# Altium schematic sheet OSD19001_BREAKOUTS.SchDoc: <title>
size B; CompanyName: Allied Component Works; Organization: Altium Limited; DocumentNumber: 3; Revision: X1; SheetNumber: 3; SheetTotal: 4; DrawingNumber: <drawing number>; SchematicTitle: OSD32MP1 BREAKOUT MODULE (BREAKOUTS)
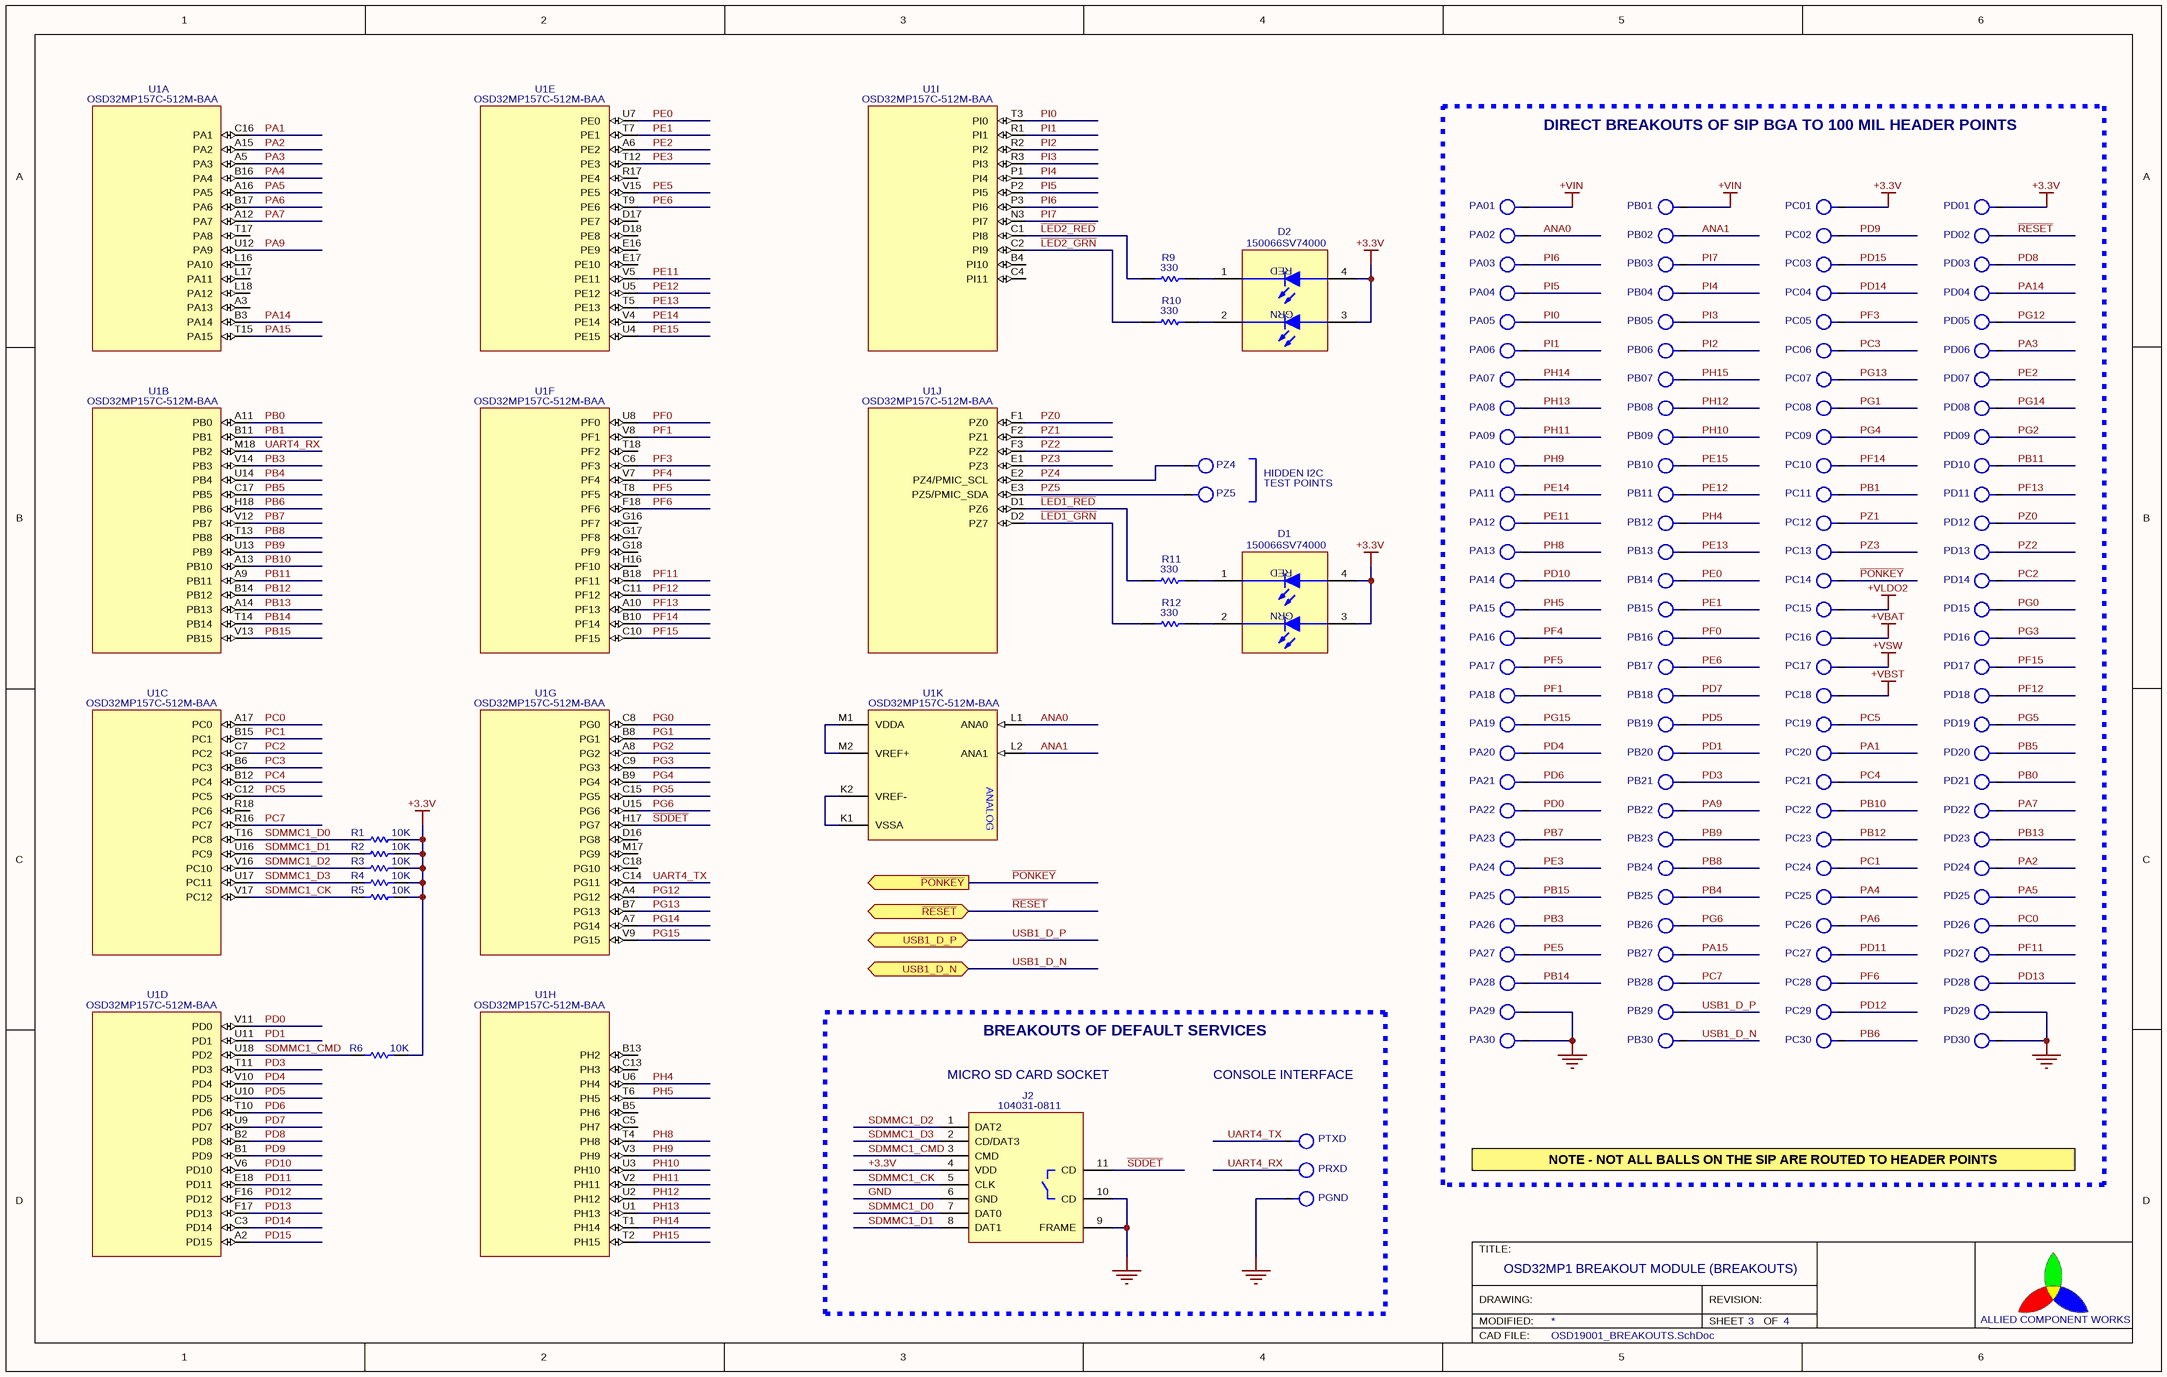
[diagram p0: OSD19001_BREAKOUTS.SchDoc]

## Parts
D1  150066SV74000  [WURTH_DUAL_0606]
D2  150066SV74000  [WURTH_DUAL_0606]
J2  104031-0811  [MOLEX_104031-0811]
PA01  TP  [LP_TESTPOINT_TH]  (value not drawn)
PA02  TP  [LP_TESTPOINT_TH]  (value not drawn)
PA03  TP  [LP_TESTPOINT_TH]  (value not drawn)
PA04  TP  [LP_TESTPOINT_TH]  (value not drawn)
PA05  TP  [LP_TESTPOINT_TH]  (value not drawn)
PA06  TP  [LP_TESTPOINT_TH]  (value not drawn)
PA07  TP  [LP_TESTPOINT_TH]  (value not drawn)
PA08  TP  [LP_TESTPOINT_TH]  (value not drawn)
PA09  TP  [LP_TESTPOINT_TH]  (value not drawn)
PA10  TP  [LP_TESTPOINT_TH]  (value not drawn)
PA11  TP  [LP_TESTPOINT_TH]  (value not drawn)
PA12  TP  [LP_TESTPOINT_TH]  (value not drawn)
PA13  TP  [LP_TESTPOINT_TH]  (value not drawn)
PA14  TP  [LP_TESTPOINT_TH]  (value not drawn)
PA15  TP  [LP_TESTPOINT_TH]  (value not drawn)
PA16  TP  [LP_TESTPOINT_TH]  (value not drawn)
PA17  TP  [LP_TESTPOINT_TH]  (value not drawn)
PA18  TP  [LP_TESTPOINT_TH]  (value not drawn)
PA19  TP  [LP_TESTPOINT_TH]  (value not drawn)
PA20  TP  [LP_TESTPOINT_TH]  (value not drawn)
PA21  TP  [LP_TESTPOINT_TH]  (value not drawn)
PA22  TP  [LP_TESTPOINT_TH]  (value not drawn)
PA23  TP  [LP_TESTPOINT_TH]  (value not drawn)
PA24  TP  [LP_TESTPOINT_TH]  (value not drawn)
PA25  TP  [LP_TESTPOINT_TH]  (value not drawn)
PA26  TP  [LP_TESTPOINT_TH]  (value not drawn)
PA27  TP  [LP_TESTPOINT_TH]  (value not drawn)
PA28  TP  [LP_TESTPOINT_TH]  (value not drawn)
PA29  TP  [LP_TESTPOINT_TH]  (value not drawn)
PA30  TP  [LP_TESTPOINT_TH]  (value not drawn)
PB01  TP  [LP_TESTPOINT_TH]  (value not drawn)
PB02  TP  [LP_TESTPOINT_TH]  (value not drawn)
PB03  TP  [LP_TESTPOINT_TH]  (value not drawn)
PB04  TP  [LP_TESTPOINT_TH]  (value not drawn)
PB05  TP  [LP_TESTPOINT_TH]  (value not drawn)
PB06  TP  [LP_TESTPOINT_TH]  (value not drawn)
PB07  TP  [LP_TESTPOINT_TH]  (value not drawn)
PB08  TP  [LP_TESTPOINT_TH]  (value not drawn)
PB09  TP  [LP_TESTPOINT_TH]  (value not drawn)
PB10  TP  [LP_TESTPOINT_TH]  (value not drawn)
PB11  TP  [LP_TESTPOINT_TH]  (value not drawn)
PB12  TP  [LP_TESTPOINT_TH]  (value not drawn)
PB13  TP  [LP_TESTPOINT_TH]  (value not drawn)
PB14  TP  [LP_TESTPOINT_TH]  (value not drawn)
PB15  TP  [LP_TESTPOINT_TH]  (value not drawn)
PB16  TP  [LP_TESTPOINT_TH]  (value not drawn)
PB17  TP  [LP_TESTPOINT_TH]  (value not drawn)
PB18  TP  [LP_TESTPOINT_TH]  (value not drawn)
PB19  TP  [LP_TESTPOINT_TH]  (value not drawn)
PB20  TP  [LP_TESTPOINT_TH]  (value not drawn)
PB21  TP  [LP_TESTPOINT_TH]  (value not drawn)
PB22  TP  [LP_TESTPOINT_TH]  (value not drawn)
PB23  TP  [LP_TESTPOINT_TH]  (value not drawn)
PB24  TP  [LP_TESTPOINT_TH]  (value not drawn)
PB25  TP  [LP_TESTPOINT_TH]  (value not drawn)
PB26  TP  [LP_TESTPOINT_TH]  (value not drawn)
PB27  TP  [LP_TESTPOINT_TH]  (value not drawn)
PB28  TP  [LP_TESTPOINT_TH]  (value not drawn)
PB29  TP  [LP_TESTPOINT_TH]  (value not drawn)
PB30  TP  [LP_TESTPOINT_TH]  (value not drawn)
PC01  TP  [LP_TESTPOINT_TH]  (value not drawn)
PC02  TP  [LP_TESTPOINT_TH]  (value not drawn)
PC03  TP  [LP_TESTPOINT_TH]  (value not drawn)
PC04  TP  [LP_TESTPOINT_TH]  (value not drawn)
PC05  TP  [LP_TESTPOINT_TH]  (value not drawn)
PC06  TP  [LP_TESTPOINT_TH]  (value not drawn)
PC07  TP  [LP_TESTPOINT_TH]  (value not drawn)
PC08  TP  [LP_TESTPOINT_TH]  (value not drawn)
PC09  TP  [LP_TESTPOINT_TH]  (value not drawn)
PC10  TP  [LP_TESTPOINT_TH]  (value not drawn)
PC11  TP  [LP_TESTPOINT_TH]  (value not drawn)
PC12  TP  [LP_TESTPOINT_TH]  (value not drawn)
PC13  TP  [LP_TESTPOINT_TH]  (value not drawn)
PC14  TP  [LP_TESTPOINT_TH]  (value not drawn)
PC15  TP  [LP_TESTPOINT_TH]  (value not drawn)
PC16  TP  [LP_TESTPOINT_TH]  (value not drawn)
PC17  TP  [LP_TESTPOINT_TH]  (value not drawn)
PC18  TP  [LP_TESTPOINT_TH]  (value not drawn)
PC19  TP  [LP_TESTPOINT_TH]  (value not drawn)
PC20  TP  [LP_TESTPOINT_TH]  (value not drawn)
PC21  TP  [LP_TESTPOINT_TH]  (value not drawn)
PC22  TP  [LP_TESTPOINT_TH]  (value not drawn)
PC23  TP  [LP_TESTPOINT_TH]  (value not drawn)
PC24  TP  [LP_TESTPOINT_TH]  (value not drawn)
PC25  TP  [LP_TESTPOINT_TH]  (value not drawn)
PC26  TP  [LP_TESTPOINT_TH]  (value not drawn)
PC27  TP  [LP_TESTPOINT_TH]  (value not drawn)
PC28  TP  [LP_TESTPOINT_TH]  (value not drawn)
PC29  TP  [LP_TESTPOINT_TH]  (value not drawn)
PC30  TP  [LP_TESTPOINT_TH]  (value not drawn)
PD01  TP  [LP_TESTPOINT_TH]  (value not drawn)
PD02  TP  [LP_TESTPOINT_TH]  (value not drawn)
PD03  TP  [LP_TESTPOINT_TH]  (value not drawn)
PD04  TP  [LP_TESTPOINT_TH]  (value not drawn)
PD05  TP  [LP_TESTPOINT_TH]  (value not drawn)
PD06  TP  [LP_TESTPOINT_TH]  (value not drawn)
PD07  TP  [LP_TESTPOINT_TH]  (value not drawn)
PD08  TP  [LP_TESTPOINT_TH]  (value not drawn)
PD09  TP  [LP_TESTPOINT_TH]  (value not drawn)
PD10  TP  [LP_TESTPOINT_TH]  (value not drawn)
PD11  TP  [LP_TESTPOINT_TH]  (value not drawn)
PD12  TP  [LP_TESTPOINT_TH]  (value not drawn)
PD13  TP  [LP_TESTPOINT_TH]  (value not drawn)
PD14  TP  [LP_TESTPOINT_TH]  (value not drawn)
PD15  TP  [LP_TESTPOINT_TH]  (value not drawn)
PD16  TP  [LP_TESTPOINT_TH]  (value not drawn)
PD17  TP  [LP_TESTPOINT_TH]  (value not drawn)
PD18  TP  [LP_TESTPOINT_TH]  (value not drawn)
PD19  TP  [LP_TESTPOINT_TH]  (value not drawn)
PD20  TP  [LP_TESTPOINT_TH]  (value not drawn)
PD21  TP  [LP_TESTPOINT_TH]  (value not drawn)
PD22  TP  [LP_TESTPOINT_TH]  (value not drawn)
PD23  TP  [LP_TESTPOINT_TH]  (value not drawn)
PD24  TP  [LP_TESTPOINT_TH]  (value not drawn)
PD25  TP  [LP_TESTPOINT_TH]  (value not drawn)
PD26  TP  [LP_TESTPOINT_TH]  (value not drawn)
PD27  TP  [LP_TESTPOINT_TH]  (value not drawn)
PD28  TP  [LP_TESTPOINT_TH]  (value not drawn)
PD29  TP  [LP_TESTPOINT_TH]  (value not drawn)
PD30  TP  [LP_TESTPOINT_TH]  (value not drawn)
PGND  TP  [LP_TESTPOINT_TH]  (value not drawn)
PRXD  TP  [LP_TESTPOINT_TH]  (value not drawn)
PTXD  TP  [LP_TESTPOINT_TH]  (value not drawn)
PZ4  TP  [LP_TESTPOINT_SMT]  (value not drawn)
PZ5  TP  [LP_TESTPOINT_SMT]  (value not drawn)
R1  10K  [LP_0402_LOW]
R2  10K  [LP_0402_LOW]
R3  10K  [LP_0402_LOW]
R4  10K  [LP_0402_LOW]
R5  10K  [LP_0402_LOW]
R6  10K  [LP_0402_LOW]
R9  330  [LP_0402_LOW]
R10  330  [LP_0402_LOW]
R11  330  [LP_0402_LOW]
R12  330  [LP_0402_LOW]
U1  OSD32MP157C-512M-BAA  [BGA_OCTAVO_SIP_OSD32MP157C]  (parts A,B,C,D,E,F,G,H,I,J,K of 17)

## Blocks framed on the sheet
DIRECT BREAKOUTS OF SIP BGA TO 100 MIL HEADER POINTS: PA01 PA02 PA03 PA04 PA05 PA06 PA07 PA08 PA09-PA30 PB01 PB02 PB03 PB04 PB05 PB06 PB07 PB08 PB09-PB30 PC01 PC02 PC03 PC04 PC05 PC06 PC07 PC08 PC09-PC30 PD01 PD02 PD03 PD04 PD05 PD06 PD07 PD08 PD09-PD30
BREAKOUTS OF DEFAULT SERVICES: J2 PGND PRXD PTXD

## Ports
USB1_D_N (bidir), USB1_D_P (bidir), ~{PONKEY} (out), ~{RESET} (bidir)

## Nets
+3.3V: D1.3(A) D1.4(A) D2.3(A) D2.4(A) J2.4(VDD) PC01.1 PD01.1 R1.2 R2.2 R3.2 R4.2 R5.2 R6.2
+VBAT: PC16.1
+VBST: PC18.1
+VIN: PA01.1 PB01.1
+VLDO2: PC15.1
+VSW: PC17.1
GND: J2.6(GND) J2.9(FRAME) J2.10(CD) PA29.1 PA30.1 PD29.1 PD30.1 PGND.1
~{LED1_GRN}: R12.1 U1.D2(PZ7)
~{LED1_RED}: R11.1 U1.D1(PZ6)
~{LED2_GRN}: R10.1 U1.C2(PI9)
~{LED2_RED}: R9.1 U1.C1(PI8)
~{PONKEY}: PC14.1 ; port ~{PONKEY}
~{RESET}: PD02.1 ; port ~{RESET}
~{SDDET}: J2.11(CD) U1.H17(PG7)
ANA0: PA02.1 U1.L1(ANA0)
ANA1: PB02.1 U1.L2(ANA1)
PA1: PC20.1 U1.C16(PA1)
PA2: PD24.1 U1.A15(PA2)
PA3: PD06.1 U1.A5(PA3)
PA4: PC25.1 U1.B16(PA4)
PA5: PD25.1 U1.A16(PA5)
PA6: PC26.1 U1.B17(PA6)
PA7: PD22.1 U1.A12(PA7)
PA9: PB22.1 U1.U12(PA9)
PA14: PD04.1 U1.B3(PA14)
PA15: PB27.1 U1.T15(PA15)
PB0: PD21.1 U1.A11(PB0)
PB1: PC11.1 U1.B11(PB1)
PB3: PA26.1 U1.V14(PB3)
PB4: PB25.1 U1.U14(PB4)
PB5: PD20.1 U1.C17(PB5)
PB6: PC30.1 U1.H18(PB6)
PB7: PA23.1 U1.V12(PB7)
PB8: PB24.1 U1.T13(PB8)
PB9: PB23.1 U1.U13(PB9)
PB10: PC22.1 U1.A13(PB10)
PB11: PD10.1 U1.A9(PB11)
PB12: PC23.1 U1.B14(PB12)
PB13: PD23.1 U1.A14(PB13)
PB14: PA28.1 U1.T14(PB14)
PB15: PA25.1 U1.V13(PB15)
PC0: PD26.1 U1.A17(PC0)
PC1: PC24.1 U1.B15(PC1)
PC2: PD14.1 U1.C7(PC2)
PC3: PC06.1 U1.B6(PC3)
PC4: PC21.1 U1.B12(PC4)
PC5: PC19.1 U1.C12(PC5)
PC7: PB28.1 U1.R16(PC7)
PD0: PA22.1 U1.V11(PD0)
PD1: PB20.1 U1.U11(PD1)
PD3: PB21.1 U1.T11(PD3)
PD4: PA20.1 U1.V10(PD4)
PD5: PB19.1 U1.U10(PD5)
PD6: PA21.1 U1.T10(PD6)
PD7: PB18.1 U1.U9(PD7)
PD8: PD03.1 U1.B2(PD8)
PD9: PC02.1 U1.B1(PD9)
PD10: PA14.1 U1.V6(PD10)
PD11: PC27.1 U1.E18(PD11)
PD12: PC29.1 U1.F16(PD12)
PD13: PD28.1 U1.F17(PD13)
PD14: PC04.1 U1.C3(PD14)
PD15: PC03.1 U1.A2(PD15)
PE0: PB14.1 U1.U7(PE0)
PE1: PB15.1 U1.T7(PE1)
PE2: PD07.1 U1.A6(PE2)
PE3: PA24.1 U1.T12(PE3)
PE5: PA27.1 U1.V15(PE5)
PE6: PB17.1 U1.T9(PE6)
PE11: PA12.1 U1.V5(PE11)
PE12: PB11.1 U1.U5(PE12)
PE13: PB13.1 U1.T5(PE13)
PE14: PA11.1 U1.V4(PE14)
PE15: PB10.1 U1.U4(PE15)
PF0: PB16.1 U1.U8(PF0)
PF1: PA18.1 U1.V8(PF1)
PF3: PC05.1 U1.C6(PF3)
PF4: PA16.1 U1.V7(PF4)
PF5: PA17.1 U1.T8(PF5)
PF6: PC28.1 U1.F18(PF6)
PF11: PD27.1 U1.B18(PF11)
PF12: PD18.1 U1.C11(PF12)
PF13: PD11.1 U1.A10(PF13)
PF14: PC10.1 U1.B10(PF14)
PF15: PD17.1 U1.C10(PF15)
PG0: PD15.1 U1.C8(PG0)
PG1: PC08.1 U1.B8(PG1)
PG2: PD09.1 U1.A8(PG2)
PG3: PD16.1 U1.C9(PG3)
PG4: PC09.1 U1.B9(PG4)
PG5: PD19.1 U1.C15(PG5)
PG6: PB26.1 U1.U15(PG6)
PG12: PD05.1 U1.A4(PG12)
PG13: PC07.1 U1.B7(PG13)
PG14: PD08.1 U1.A7(PG14)
PG15: PA19.1 U1.V9(PG15)
PH4: PB12.1 U1.U6(PH4)
PH5: PA15.1 U1.T6(PH5)
PH8: PA13.1 U1.T4(PH8)
PH9: PA10.1 U1.V3(PH9)
PH10: PB09.1 U1.U3(PH10)
PH11: PA09.1 U1.V2(PH11)
PH12: PB08.1 U1.U2(PH12)
PH13: PA08.1 U1.U1(PH13)
PH14: PA07.1 U1.T1(PH14)
PH15: PB07.1 U1.T2(PH15)
PI0: PA05.1 U1.T3(PI0)
PI1: PA06.1 U1.R1(PI1)
PI2: PB06.1 U1.R2(PI2)
PI3: PB05.1 U1.R3(PI3)
PI4: PB04.1 U1.P1(PI4)
PI5: PA04.1 U1.P2(PI5)
PI6: PA03.1 U1.P3(PI6)
PI7: PB03.1 U1.N3(PI7)
PZ0: PD12.1 U1.F1(PZ0)
PZ1: PC12.1 U1.F2(PZ1)
PZ2: PD13.1 U1.F3(PZ2)
PZ3: PC13.1 U1.E1(PZ3)
PZ4: PZ4.1 U1.E2(PZ4/PMIC_SCL)
PZ5: PZ5.1 U1.E3(PZ5/PMIC_SDA)
SDMMC1_CK: J2.5(CLK) R5.1 U1.V17(PC12)
SDMMC1_CMD: J2.3(CMD) R6.1 U1.U18(PD2)
SDMMC1_D0: J2.7(DAT0) R1.1 U1.T16(PC8)
SDMMC1_D1: J2.8(DAT1) R2.1 U1.U16(PC9)
SDMMC1_D2: J2.1(DAT2) R3.1 U1.V16(PC10)
SDMMC1_D3: J2.2(CD/DAT3) R4.1 U1.U17(PC11)
UART4_RX: PRXD.1 U1.M18(PB2)
UART4_TX: PTXD.1 U1.C14(PG11)
USB1_D_N: PB30.1 ; port USB1_D_N
USB1_D_P: PB29.1 ; port USB1_D_P
NetD1_1: D1.1(K) R11.2
NetD1_2: D1.2(K) R12.2
NetD2_1: D2.1(K) R9.2
NetD2_2: D2.2(K) R10.2
NetU1_K1: U1.K1(VSSA) U1.K2(VREF-)
NetU1_M1: U1.M1(VDDA) U1.M2(VREF+)

Not connected (* = marked no-connect by the designer): U1 A3(PA13) B4(PI10) B5(PH6) B13(PH2) C4(PI11) C5(PH7) C13(PH3) C18(PG10) D16(PG8) D17(PE7) D18(PE8) E16(PE9) E17(PE10) G16(PF7) G17(PF8) G18(PF9) H16(PF10) L16(PA10) L17(PA11) L18(PA12) M17(PG9) R17(PE4) R18(PC6) T17(PA8) T18(PF2)

## Notes on the sheet
- HIDDEN I2C
- TEST POINTS
- (near J2) MICRO SD CARD SOCKET
- CONSOLE INTERFACE
- NOTE - NOT ALL BALLS ON THE SIP ARE ROUTED TO HEADER POINTS
- TITLE:
- DRAWING:
- MODIFIED:
- REVISION:
- SHEET
- OF
- ALLIED COMPONENT WORKS
- CAD FILE:
- (in symbol LED_DUAL_0606_WURTH) RED; GRN
- (in symbol OSD32MP157C, part K) ANALOG

## Library data of the parts
D1 D2 = LED_DUAL_0606_WURTH: LED, Dual, 4-Wire, SMT; PartNumber: 150066SV74000
J2 = SD_CARD_SW: Micro SD Connector, With CD Switch; PartNumber: 104031-0811
PA01 PA02 PA03 PA04 PA05 PA06 PA07 PA08 PA09-PA30 PB01 PB02 PB03 PB04 PB05 PB06 PB07 PB08 PB09-PB30 PC01 PC02 PC03 PC04 PC05 PC06 PC07 PC08 PC09-PC30 PD01 PD02 PD03 PD04 PD05 PD06 PD07 PD08 PD09-PD30 PGND PRXD PTXD PZ4 PZ5 = TEST_POINT
R1-R6 R9-R12 = RESISTOR: Tolerance: 5%; Power: 0.1W; Voltage: 50V
  R1-R6: Value: 10K
  R9-R12: Value: 330
U1 = OSD32MP157C: Octavo ST Processor SIP; Manufacturer: Octavo Systems; PartNumber: OSD32MP157C-512M-BAA; ComponentLink1Description: TBD; ComponentLink1URL: http://TBD